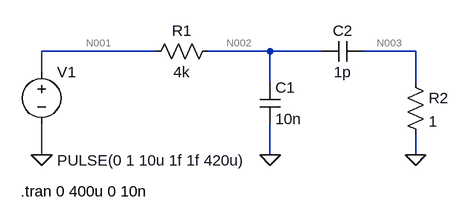
[diagram p0: schematic DIF-цепь.asc]
DIF-цепь.asc, the LTspice schematic file:
Version 4
SHEET 1 880 680
WIRE 80 16 -96 16
WIRE 256 16 160 16
WIRE 336 16 256 16
WIRE 480 16 400 16
WIRE -96 48 -96 16
WIRE 256 64 256 16
WIRE 480 64 480 16
WIRE -96 176 -96 128
WIRE 256 176 256 128
WIRE 480 176 480 144
FLAG -96 176 0
FLAG 256 176 0
FLAG 480 176 0
SYMBOL voltage -96 32 R0
WINDOW 3 24 152 Left 2
WINDOW 123 0 0 Left 0
WINDOW 39 24 180 Left 2
SYMATTR Value PULSE(0 1 10u 1f 1f 420u)
SYMATTR InstName V1
SYMBOL res 176 0 R90
WINDOW 0 0 56 VBottom 2
WINDOW 3 32 56 VTop 2
SYMATTR InstName R1
SYMATTR Value 4k
SYMBOL cap 240 64 R0
SYMATTR InstName C1
SYMATTR Value 10n
SYMBOL cap 400 0 R90
WINDOW 0 0 32 VBottom 2
WINDOW 3 32 32 VTop 2
SYMATTR InstName C2
SYMATTR Value 1p
SYMBOL res 464 48 R0
SYMATTR InstName R2
SYMATTR Value 1
TEXT -128 232 Left 2 !.tran 0 400u 0 10n

The netlist it stands for:
* DIF-цепь.asc
V1 N001 0 PULSE(0 1 10u 1f 1f 420u)
R1 N002 N001 4k
C1 N002 0 10n
C2 N003 N002 1p
R2 N003 0 1
.tran 0 400u 0 10n
.backanno
.end

* Results of the author's LTspice run, read from the files saved beside the schematic
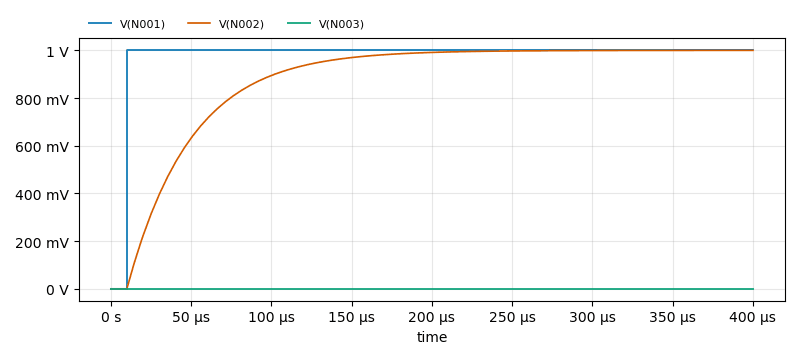
[diagram p1: Transient Analysis of DIF-цепь.asc, plotted from the saved traces]
* Transient Analysis, 1 run:
*   V(N001): min 0 V, max 1 V, average 975 mV, rms 987.4 mV, last 1 V
*   V(N002): min 0 V, max 999.9 mV, average 874.9 mV, rms 908.3 mV, last 999.9 mV
*   V(N003): min 0 V, max 25.03 nV, average 2.503 nV, rms 5.604 nV, last 1.459 pV